# EAGLE design BeagleQ-v03.1 (EAGLE 6.6.0)
BOARD_NUMBER: 1.0
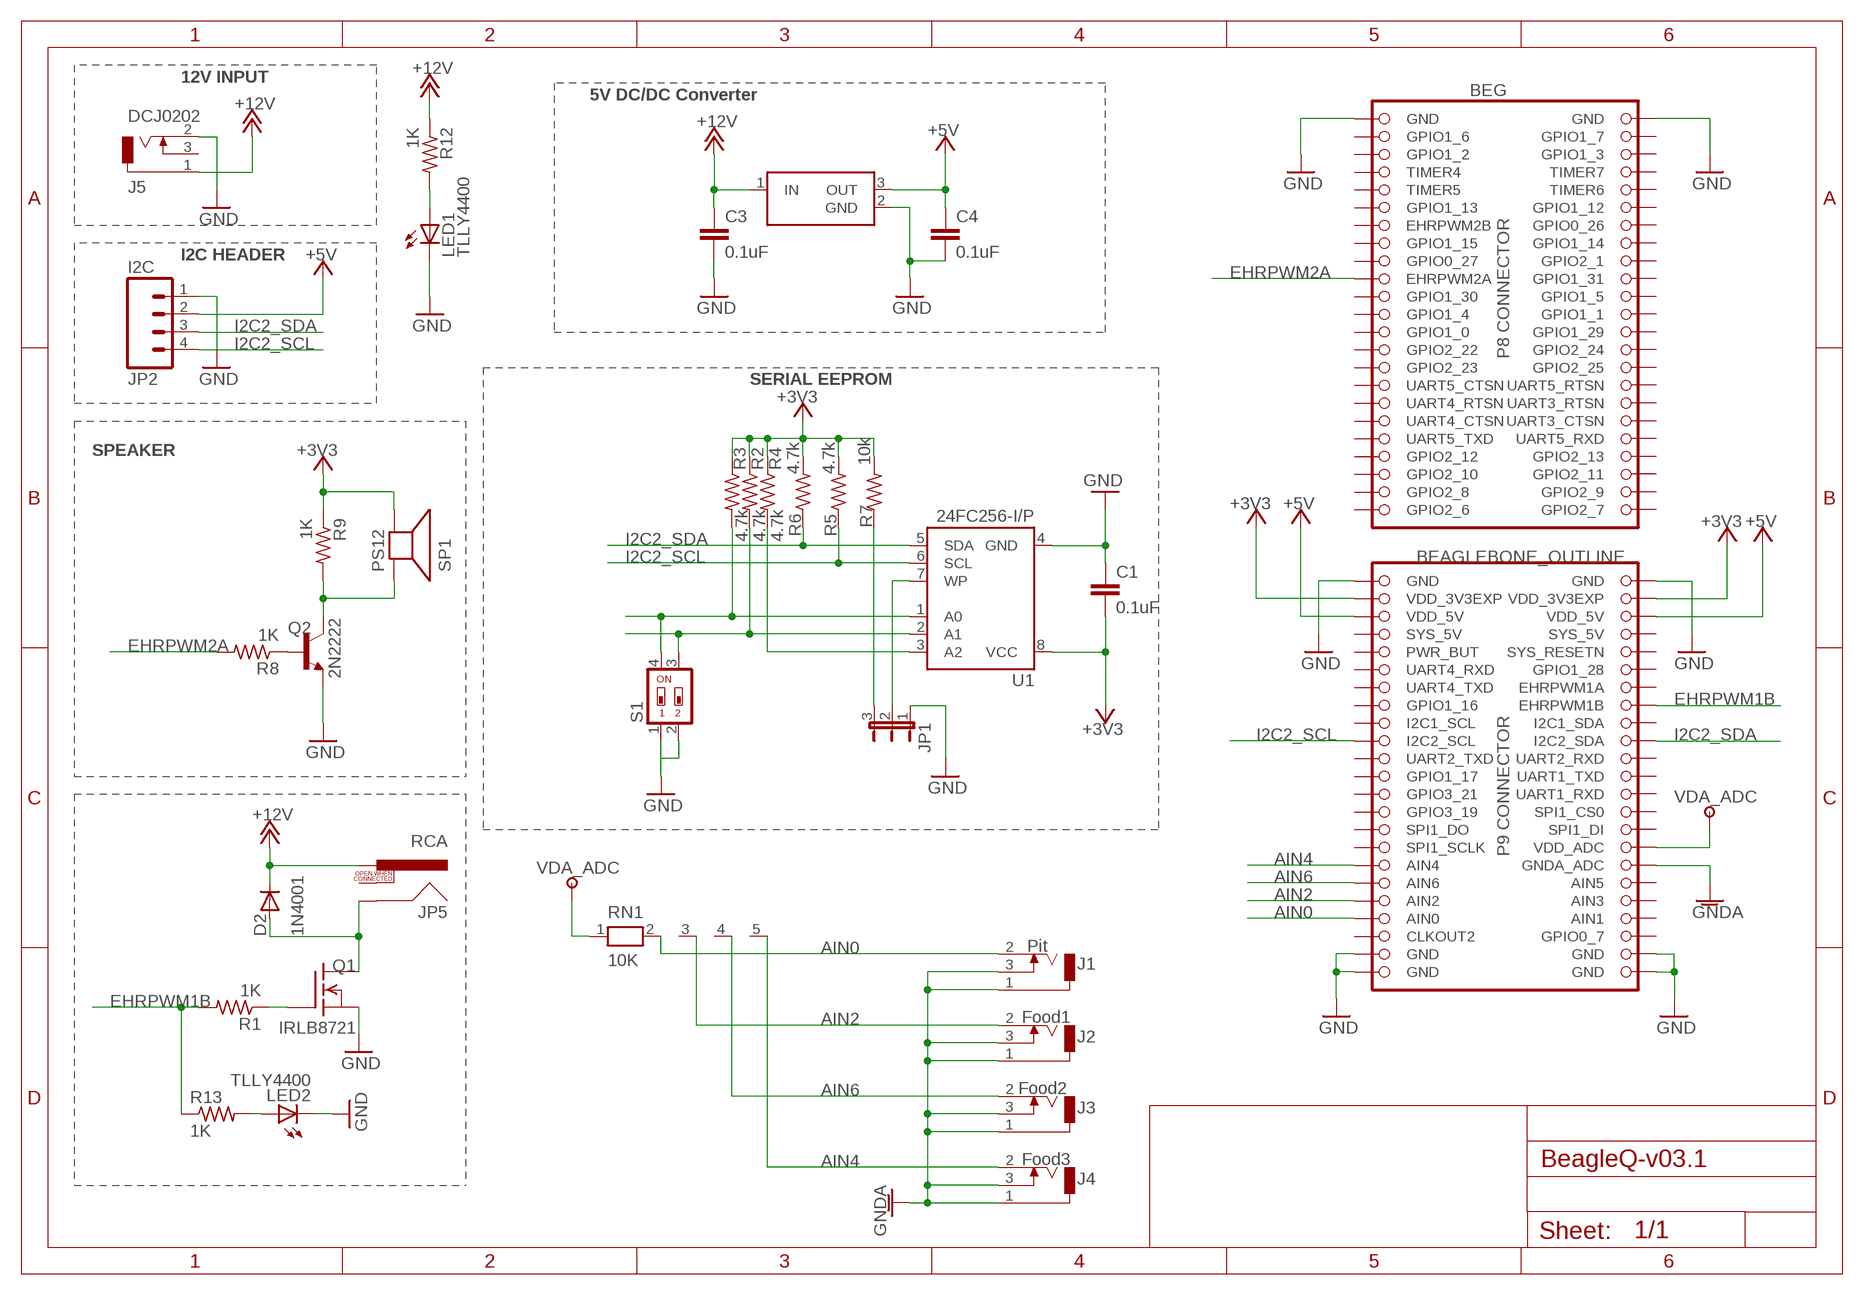
[diagram p0: schematic, sheet 1]

## Parts
BEG  BEAGLEBONE_OUTLINE  [BEAGLEBONE_SHIELD]
C1  0.1uF  C2.5/2  [C2.5-2]
C3  0.1uF  C2.5/2  [C2.5-2]
C4  0.1uF  C2.5/2  [C2.5-2]
D2  1N4001  1N4004  [DO41-10]
J1  Pit  MJ-2508N  [MJ-2508N]
J2  Food1  MJ-2508N  [MJ-2508N]
J3  Food2  MJ-2508N  [MJ-2508N]
J4  Food3  MJ-2508N  [MJ-2508N]
J5  DCJ0202  [DCJ0202]
JP1  WP  JP2E  [JP2]
JP2  I2C  M04PTH  [1X04]
JP5  RCA  [RCA]
LED1  TLLY4400  [LED3MM]
LED2  TLLY4400  [LED3MM]
Q1  IRLB8721  BUZ10  [TO220]
Q2  2N2222  [TO18]
R1  1K  R-US_0207/10  [0207/10]
R2  4.7k  R-US_0207/10  [0207/10]
R3  4.7k  R-US_0207/10  [0207/10]
R4  4.7k  R-US_0207/10  [0207/10]
R5  4.7k  R-US_0207/10  [0207/10]
R6  4.7k  R-US_0207/10  [0207/10]
R7  10k  R-US_0207/10  [0207/10]
R8  1K  R-US_0207/10  [0207/10]
R9  1K  R-US_0207/10  [0207/10]
R12  1K  R-US_0207/10  [0207/10]
R13  1K  R-US_0207/10  [0207/10]
RN1  10K  RN04  [RN-5]
S1  SWS002  [SMS-002]
SP1  PS12  SPEAKER/PS12  [PS12]
U1  24FC256-I/P  AT24CP  [DIL08]
U2  OKI-78SR  [OKI-78SR]

## Nets
+3V3: BEG.49(VDD_3V3EXP) BEG.50(VDD_3V3EXP) C1.2 R2.1 R3.1 R4.1 R5.2 R6.2 R7.2 R9.1 SP1.P$2(-) U1.8(VCC)
+5V [VDD]: BEG.51(VDD_5V) BEG.52(VDD_5V) C4.1 JP2.2 U2.3(OUT)
+12V: C3.1 D2.C J5.1 JP5.PIN R12.1 U2.1(IN)
AIN0: BEG.85(AIN0) J1.2 RN1.2
AIN2: BEG.83(AIN2) J2.2 RN1.3
AIN4: BEG.79(AIN4) J4.2 RN1.5
AIN6: BEG.81(AIN6) J3.2 RN1.4
BLOWER_L [VCC_12V]: D2.A JP5.SHELL Q1.2(D)
EHRPWM1B: BEG.62(EHRPWM1B) R1.2 R13.1
EHRPWM2A: BEG.19(EHRPWM2A) R8.2
GND [GND]: BEG.1(GND) BEG.2(GND) BEG.47(GND) BEG.48(GND) BEG.89(GND) BEG.90(GND) BEG.91(GND) BEG.92(GND) C1.1 C3.2 C4.2 J5.2 JP1.1 JP2.1 LED1.K(C) LED2.K(C) Q1.3(S) Q1.4(S) Q2.1(E) S1.1 S1.2 U1.4(GND) U2.2(GND)
GNDA: BEG.80(GNDA_ADC) J1.1 J1.3 J2.1 J2.3 J3.1 J3.3 J4.1 J4.3
I2C2_SCL: BEG.65(I2C2_SCL) JP2.4 R5.1 U1.6(SCL)
I2C2_SDA: BEG.66(I2C2_SDA) JP2.3 R6.1 U1.5(SDA)
N$1: R2.2 S1.3 U1.2(A1)
N$2: R3.2 S1.4 U1.1(A0)
N$3: JP1.2 U1.7(WP)
N$4: Q1.1(G) R1.1
N$5: JP1.3 R7.1
N$8: LED1.A R12.2
N$9: R4.2 U1.3(A2)
N$10: LED2.A R13.2
N$12: Q2.2(B) R8.1
N$13: Q2.3(C) R9.2 SP1.P$1(+)
VDA_ADC: BEG.78(VDD_ADC) RN1.1
Unconnected: BEG.3(GPIO1_6) BEG.4(GPIO1_7) BEG.5(GPIO1_2) BEG.6(GPIO1_3) BEG.7(TIMER4) BEG.8(TIMER7) BEG.9(TIMER5) BEG.10(TIMER6) BEG.11(GPIO1_13) BEG.12(GPIO1_12) BEG.13(EHRPWM2B) BEG.14(GPIO0_26) BEG.15(GPIO1_15) BEG.16(GPIO1_14) BEG.17(GPIO0_27) BEG.18(GPIO2_1) BEG.20(GPIO1_31) BEG.21(GPIO1_30) BEG.22(GPIO1_5) BEG.23(GPIO1_4) BEG.24(GPIO1_1) BEG.25(GPIO1_0) BEG.26(GPIO1_29) BEG.27(GPIO2_22) BEG.28(GPIO2_24) BEG.29(GPIO2_23) BEG.30(GPIO2_25) BEG.31(UART5_CTSN) BEG.32(UART5_RTSN) BEG.33(UART4_RTSN) BEG.34(UART3_RTSN) BEG.35(UART4_CTSN) BEG.36(UART3_CTSN) BEG.37(UART5_TXD) BEG.38(UART5_RXD) BEG.39(GPIO2_12) BEG.40(GPIO2_13) BEG.41(GPIO2_10) BEG.42(GPIO2_11) BEG.43(GPIO2_8) BEG.44(GPIO2_9) BEG.45(GPIO2_6) BEG.46(GPIO2_7) BEG.54(SYS_5V) BEG.55(PWR_BUT) BEG.56(SYS_RESETN) BEG.57(UART4_RXD) BEG.58(GPIO1_28) BEG.59(UART4_TXD) BEG.60(EHRPWM1A) BEG.61(GPIO1_16) BEG.63(I2C1_SCL) BEG.64(I2C1_SDA) BEG.67(UART2_TXD) BEG.68(UART2_RXD) BEG.69(GPIO1_17) BEG.70(UART1_TXD) BEG.71(GPIO3_21) BEG.72(UART1_RXD) BEG.73(GPIO3_19) BEG.74(SPI1_CS0) BEG.75(SPI1_DO) BEG.76(SPI1_DI) BEG.77(SPI1_SCLK) BEG.82(AIN5) BEG.84(AIN3) BEG.86(AIN1) BEG.87(CLKOUT2) BEG.88(GPIO0_7) J5.3 JP5.SWITCH

## Notes on the sheet
- 12V INPUT
- 5V DC/DC Converter
- I2C HEADER
- SERIAL EEPROM
- SPEAKER

## Power pins joined to a net without a drawn wire
SYS_5V: BEG.53(SYS_5V)

## Library data of the parts
BEG = BeagleQ-v03:BEAGLEBONE_OUTLINE: Should match A3 pinout - but not completely tested
C1 C3 C4 = capacitor-wima:C: CAPACITOR naming: grid - package width
D2 = BeagleQ-v03:1N4004: DIODE General purpose 1N400x type rectifier (With bigger pads) http://www.ladyada.net/library/pcb/eaglelibrary.html
J1-J4 = BeagleQ-v03:MJ-2508N
J5 = BeagleQ-v03:DCJ0202: DC POWER JACK Source: DCJ0202.pdf; OC_FARNELL: unknown; OC_NEWARK: unknown
JP1 = jumper:JP2E: JUMPER
JP2 = SparkFun-Connectors:M04: Header 4 Standard 4-pin 0.1" header. Use with straight break away headers (SKU : PRT-00116), right angle break away headers (PRT-00553), swiss pins (PRT-00743), machine pins (PRT-00117), and female headers (PRT-00115). Molex polarized connector foot print use with SKU : PRT-08231 with associated crimp pins and housings. 1MM SMD Version SKU: PRT-10208
JP5 = BeagleQ-v03:RCA
LED1 = led:TLLY4400: Low Current (2mA) LED 3 mm Tinted Diffused Package color YELLOW Source: Data sheet <http://www.farnell.com/datasheets/391098.pdf>; MF: VISHAY SEMICONDUCTOR; OC_FARNELL: 1612439
LED2 = BeagleQ-v03:TLLY4400: Low Current (2mA) LED 3 mm Tinted Diffused Package color YELLOW Source: Data sheet <http://www.farnell.com/datasheets/391098.pdf>; MF: VISHAY SEMICONDUCTOR; OC_FARNELL: 1612439
Q1 = BeagleQ-v03:BUZ10: N-Channel Enhancement MOSFET 50V; 20A; 0,080Ohm
Q2 = BeagleQ-v03:2N2222*: NPN Transistor
R1 R8 R9 = BeagleQ-v03:R-US_: RESISTOR, American symbol
R2-R7 R12 R13 = resistor:R-US_: RESISTOR, American symbol
RN1 = BeagleQ-v03:RN04: RESISTOR NETWORK; OC_FARNELL: unknown; OC_NEWARK: unknown
S1 = BeagleQ-v03:SWS002: SMD Dip Switch 2 pol.
SP1 = adafruit:SPEAKER: SPEAKER Source: Buerklin Added PS12 (for part # PS1240 piezo) http://www.ladyada.net/library/pcb/eaglelibrary.html
U1 = BeagleQ-v03:AT24C*: 2-wire serial EEPROM; MPN: AT24C1024BW-SH-B; OC_FARNELL: 1362646; OC_NEWARK: 03P2044
U2 = BeagleQ-v03:OKI-78SR

## Net classes
0 default: width 0.203 mm
1 VCC_12V: width 0.305 mm, drill 0.406 mm
2 VDD: width 0.305 mm, drill 0.406 mm
3 GND: width 0.254 mm, drill 0.406 mm

## Board
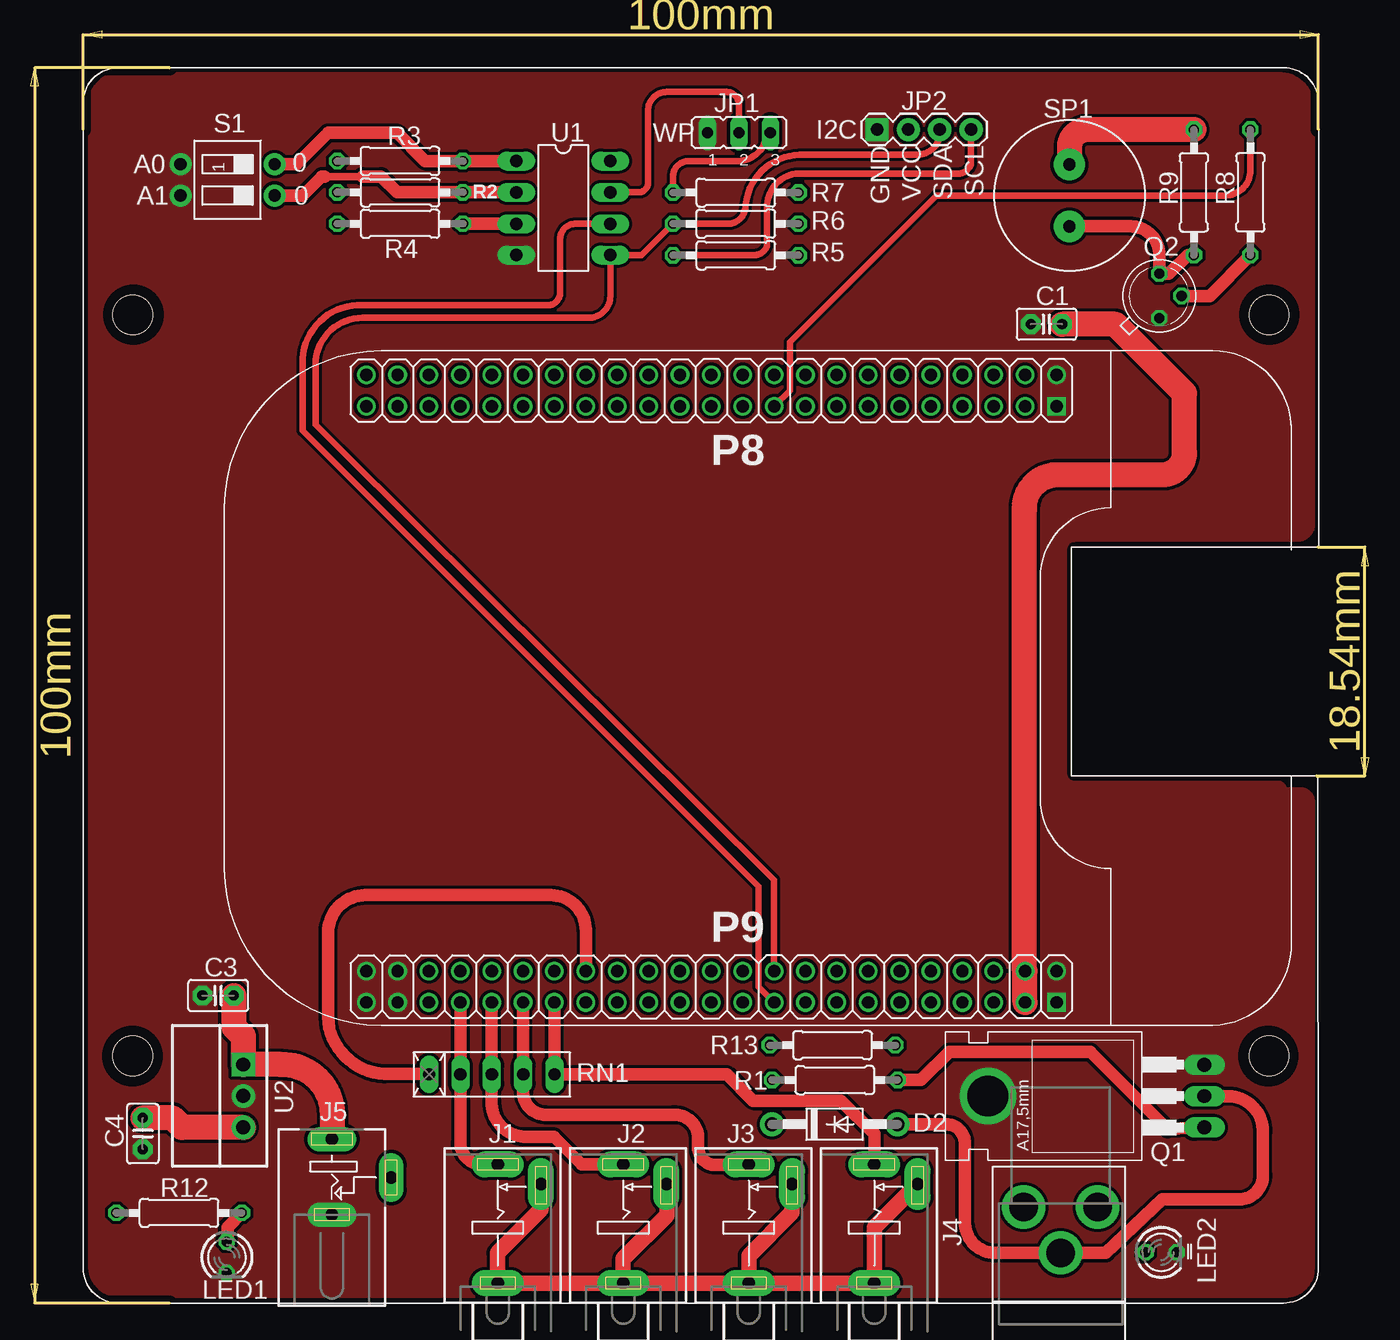
[diagram p1: board, top side]
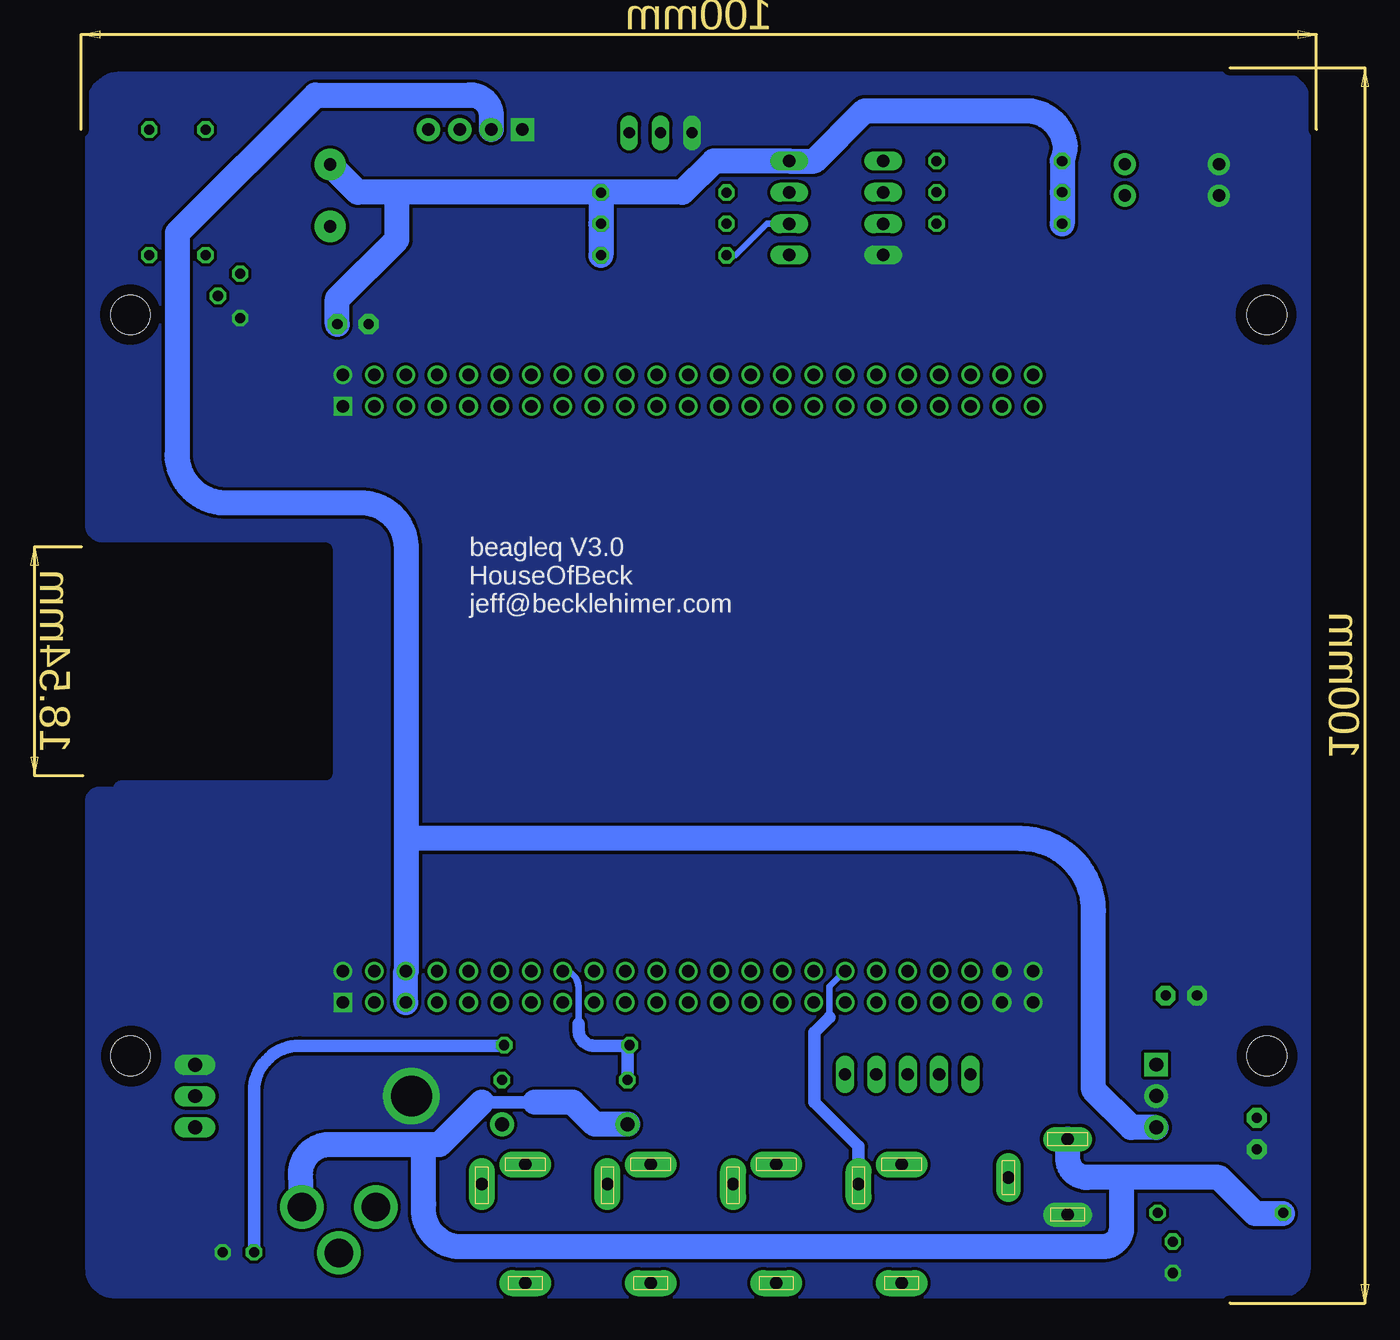
[diagram p2: board, bottom side, seen from below]

Size 108.3 x 102.99 mm. Coordinates in mm from the lower left corner, seen from the top.
Copper layers 1*16: Top 0.035mm / dielectric 1.5mm / Bottom 0.035mm
Design rules "dirt_cheap_dirty_boards.v1 *": minimum track width 5mil, minimum drill 12mil, track to track 10mil, track to pad 10mil, pad to pad 10mil, via to via 10mil, smd to smd 0mil, copper to edge 20mil, drill to drill 20mil, minimum pad ring 10mil, minimum via ring 6mil, stop-mask expansion 2mil, vias tented up to drill 25mil, thermal gap 10mil
tRestrict: area 98.1,77.8 to 102.4,82.2; area 6.1,77.8 to 10.5,82.2; area 6,17.8 to 10.4,22.2; area 98,17.8 to 102.4,22.2
bRestrict: area 98.1,77.8 to 102.4,82.2; area 6.1,77.8 to 10.5,82.2; area 6,17.8 to 10.4,22.2; area 98,17.8 to 102.4,22.2

### Footprints (pad centres in the part's own frame; a part is rotated, then mirrored left to right if it is on the bottom)
BEAGLEBONE_SHIELD = drill 1 square: 1 78.79,72.595; 47 78.79,24.335 | drill 1: 2 78.79,75.135; 3 76.25,72.595; 4 76.25,75.135; 5 73.71,72.595; 6 73.71,75.135; 7 71.17,72.595; 8 71.17,75.135; 9 68.63,72.595; 10 68.63,75.135; 11 66.09,72.595; 12 66.09,75.135; 13 63.55,72.595; 14 63.55,75.135; 15 61.01,72.595; 16 61.01,75.135; 17 58.47,72.595; 18 58.47,75.135; 19 55.93,72.595; 20 55.93,75.135; 21 53.39,72.595; 22 53.39,75.135; 23 50.85,72.595; 24 50.85,75.135; 25 48.31,72.595; 26 48.31,75.135; 27 45.77,72.595; 28 45.77,75.135; 29 43.23,72.595; 30 43.23,75.135; 31 40.69,72.595; 32 40.69,75.135; 33 38.15,72.595; 34 38.15,75.135; 35 35.61,72.595; 36 35.61,75.135; 37 33.07,72.595; 38 33.07,75.135; 39 30.53,72.595; 40 30.53,75.135; 41 27.99,72.595; 42 27.99,75.135; 43 25.45,72.595; 44 25.45,75.135; 45 22.91,72.595; 46 22.91,75.135; 48 78.79,26.875; 49 76.25,24.335; 50 76.25,26.875; 51 73.71,24.335; 52 73.71,26.875; 53 71.17,24.335; 54 71.17,26.875; 55 68.63,24.335; 56 68.63,26.875; 57 66.09,24.335; 58 66.09,26.875; 59 63.55,24.335; 60 63.55,26.875; 61 61.01,24.335; 62 61.01,26.875; 63 58.47,24.335; 64 58.47,26.875; 65 55.93,24.335; 66 55.93,26.875; 67 53.39,24.335; 68 53.39,26.875; 69 50.85,24.335; 70 50.85,26.875; 71 48.31,24.335; 72 48.31,26.875; 73 45.77,24.335; 74 45.77,26.875; 75 43.23,24.335; 76 43.23,26.875; 77 40.69,24.335; 78 40.69,26.875; 79 38.15,24.335; 80 38.15,26.875; 81 35.61,24.335; 82 35.61,26.875; 83 33.07,24.335; 84 33.07,26.875; 85 30.53,24.335; 86 30.53,26.875; 87 27.99,24.335; 88 27.99,26.875; 89 25.45,24.335; 90 25.45,26.875; 91 22.91,24.335; 92 22.91,26.875 | hole 3.2: 4,80; 96,80; 96,20; 4,20
C2.5-2 = drill 0.813 pad 1.6 octagon: 1 -1.27,0; 2 1.27,0
DO41-10 = drill 1.118 pad 1.93: A 5.08,0; C -5.08,0
MJ-2508N = drill 1 pad 2.1 long: 1 0,-6.52; 2 0,3.1; 3 3.5,1.5
DCJ0202 = drill 1 pad 2 long: 1 0,3.1; 2 0,-3; 3 4.8,0
JP2 = drill 0.914 long: 1 -2.54,0; 2 0,0; 3 2.54,0
1X04 = drill 1.016 pad 1.88 square: 1 0,0 | drill 1.016 pad 1.88: 2 2.54,0; 3 5.08,0; 4 7.62,0
RCA = drill 2.3 pad 3.5: PIN -3.7,3; SHELL 0,0; SWITCH -3.7,-3
LED3MM = drill 0.813 octagon: A -1.27,0; K 1.27,0
TO220 = drill 1.118 long: 1 -2.54,-6.35; 2 0,-6.35; 3 2.54,-6.35 | drill 3.302 pad 4.572: 4 0,11.176
TO18 = drill 0.813 octagon: 1 -1.27,-1.27; 2 1.27,-1.27; 3 1.27,1.27
0207/10 = drill 0.813 octagon: 1 -5.08,0; 2 5.08,0
RN-5 = drill 1 long: 1 -5.08,0; 2 -2.54,0; 3 0,0; 4 2.54,0; 5 5.08,0
SMS-002 = drill 1 pad 1.778: 1 -1.27,-3.81; 2 1.27,-3.81; 3 1.27,3.81; 4 -1.27,3.81
PS12 = drill 1 pad 2.54: P$1 -2.5,0; P$2 2.5,0
DIL08 = drill 1.016 long: 1 -3.81,-3.81; 2 -1.27,-3.81; 3 1.27,-3.81; 4 3.81,-3.81; 5 3.81,3.81; 6 1.27,3.81; 7 -1.27,3.81; 8 -3.81,3.81
OKI-78SR = drill 1.118 pad 1.905 square: 1 -2.54,0 | drill 1.118 pad 1.905: 2 0,0; 3 2.54,0

### Placement (x,y rotation side)
BEG  4.24,0 0 top
C1  82.21,79.25 0 top
C3  15.16,24.89 180 top
C4  9.06,13.72 270 top
D2  65.07,14.47 0 top
J1  37.8,8.13 0 top
J2  47.96,8.13 0 top
J3  58.12,8.13 0 top
J4  68.28,8.13 0 top
J5  24.37,10.16 0 top
JP1  57.32,94.74 0 top
JP2  68.5,95 0 top
JP5  83.36,4.06 270 top
LED1  15.86,3.7 270 top
LED2  91.5,4.11 0 top
Q1  88.65,16.75 90 top
Q2  91.36,81.53 45 top
R1  65.08,18.05 180 top
R2  29.89,89.92 0 top
R3  29.89,92.46 0 top
R4  29.89,87.38 0 top
R5  57.07,84.82 0 top
R6  57.07,87.38 0 top
R7  57.07,89.9 0 top
R8  98.72,89.92 90 top
R9  94.15,89.92 270 top
R12  12,7.3 0 top
R13  64.9,20.88 0 top
RN1  37.31,18.51 0 top
S1  15.92,90.93 270 top
SP1  84.07,89.66 90 top
U1  43.1,88.65 270 top
U2  17.19,16.76 270 top

### Tracks (layer width: path | path; a pad name or v marks a point on that pad's centre or on a via)
+3V3
  Top 2.032: BEG.49 BEG.50 arc-90 80.44,26.93 80.44,64.26 arc-90 82.98,67.06 91.61,67.06 arc90 93.39,68.83 93.39,73.66 87.8,79.25 C1.2 | R9.1 85.52,95 arc90 84.07,93.55 SP1.P$2
  Bottom 2.032: R5.2 R6.2 R7.2 | R7.2 62.13,89.92 55.55,89.92 53.01,92.46 U1.8 44.88,92.46 40.81,96.52 27.86,96.52 arc90 24.56,93.47 R3.1 R2.1 R4.1 | R7.2 arc-90 62.16,89.92 78.66,89.92 | 78.66,89.92 81.83,89.92 SP1.P$2 | C1.2 83.48,81.28 78.66,86.11 78.66,89.92
+5V
  Top 2.032: U2.3 12.24,14.22 11.48,14.99 C4.1
  Bottom 2.032: U2.3 19.22,14.22 22.27,17.27 22.27,31.75 arc-90 28.11,37.59 77.9,37.59 | BEG.51 BEG.52 arc-90 77.9,26.93 77.9,37.59 | 77.9,37.59 77.9,61.21 arc-90 81.71,64.77 92.63,64.77 arc90 96.44,68.83 96.44,86.61 85.26,97.79 72.82,97.79 arc90 71.04,96.27 JP2.2
+12V
  Top 1.016: J5.1 arc90 24.43,13.32
  Top 2.032: 24.43,13.32 24.43,15.37 arc90 20.24,19.3 U2.1 17.19,21.59 16.43,22.35 C3.1
  Bottom 1.016: R12.1 arc90 6.98,7.24 | 67.48,16.26 71.8,16.26
  Bottom 2.032: 6.98,7.24 9.19,7.24 12.11,10.16 19.98,10.16 | 76.5,12.83 75.23,12.83 71.8,16.26 | 76.5,12.83 84.12,12.83 arc-90 86.48,10.46 JP5.PIN | D2.C 62.65,14.47 64.44,16.26 67.48,16.26 | 76.5,12.83 76.5,8 arc-90 73.83,4.57 21.51,4.57 arc-90 19.98,6.1 19.98,10.16 | 19.98,10.16 22.78,10.16 arc90 24.37,11.75 J5.1
AIN0
  Top 0.508: BEG.85
  Top 1.016: BEG.85 RN1.2 34.77,12.98 arc90 36.53,11.23 J1.2
AIN2
  Top 0.508: BEG.83
  Top 1.016: BEG.83 RN1.3 37.31,16.33 arc90 39.92,13.46 42.34,13.46 44.57,11.23 J2.2
AIN4
  Top 0.508: BEG.79
  Top 1.016: BEG.79 RN1.5 56.34,18.51 58.47,16.38 65.58,16.38 68.28,13.68 J4.2
AIN6
  Top 0.508: BEG.81
  Top 1.016: BEG.81 RN1.4 39.85,17.09 arc90 41.7,15.24 51.99,15.24 arc-90 54.02,13.46 54.02,12.45 arc90 55.55,11.18 58.07,11.18 arc90 J3.2
BLOWER_L
  Top 1.016: Q1.2 96.96,16.75 arc-90 99.74,13.84 99.74,10.41 arc-90 97.84,8.38 91.61,8.38 87.04,4.06 JP5.SHELL 78.28,4.06 arc-90 75.61,6.35 75.61,12.95 arc90 74.09,14.47 D2.A
EHRPWM1B
  Bottom 0.508: 63.98,22.61 63.98,25.63 arc-90 BEG.62
  Bottom 1.016: R1.2 60.01,20.69 R13.1 arc90 59.87,20.83 62.68,20.83 arc90 63.95,22.1 63.98,22.61
EHRPWM2A
  Top 0.508: R8.2 98.72,91.69 arc-90 96.69,89.66 73.32,89.66 61.44,77.78 61.44,73.87 BEG.19
GND
  pour Top (no thermals): 7.29,99.57 100.76,99.57 101.01,99.57 arc-90 103.8,96.77 103.8,62.99 arc-90 102.53,61.72 84.5,61.72 arc90 83.74,60.96 83.74,42.93 arc90 84.5,42.16 101.01,42.16 arc-90 101.52,41.66 102.79,41.66 arc-90 103.8,40.64 103.8,2.79 arc-90 101.52,0.51 7.29,0.51 arc-90 4.75,3.05 4.75,97.03 arc-90
  pour Bottom (no thermals): 7.29,99.57 101.01,99.57 arc-90 103.8,96.77 103.8,62.99 arc-90 102.53,61.72 84.5,61.72 arc90 83.74,60.96 83.74,42.93 arc90 84.5,42.16 101.01,42.16 arc-90 101.52,41.66 102.79,41.66 arc-90 103.8,40.64 103.8,2.79 arc-90 101.52,0.51 7.29,0.51 arc-90 4.75,3.05 4.75,97.03 arc-90
GNDA
  Top 1.27: J2.1 J1.1 37.77,1.64 37.77,4.06 41.3,7.6 J1.3 | J2.1 J3.1 | J3.1 J4.1 68.28,6.13 J4.3 | J2.1 47.96,3.59 51.48,7.11 51.48,9.6 J2.3 | J3.1 58.12,3.84 61.62,7.34 J3.3
  Bottom 0.508: 43.66,23.11 43.66,25.66 BEG.80
  Bottom 1.016: 37.77,1.64 J1.1 | J1.3 41.3,12.68 44.88,16.26 44.88,21.89 43.66,23.11
I2C2_SCL
  Top 0.508: BEG.65 58.9,25.6 58.9,33.73 22.02,70.61 22.02,76.45 arc-90 26.84,80.77 41.83,80.77 arc90 42.84,81.79 42.84,86.11 arc-90 44.12,87.38 U1.6 | R5.1 arc-90 52.01,84.84 58.59,84.84 arc90 59.61,85.85 59.61,88.9 arc-90 62.4,91.44 75.1,91.44 arc90 76.12,92.46 JP2.4
  Bottom 0.508: R5.1 51.24,84.82 48.69,87.38 U1.6
I2C2_SDA
  Top 0.508: BEG.66 60.17,34.24 25.06,69.09 23.03,71.12 23.03,75.95 arc-90 26.84,79.76 45.13,79.76 arc90 46.91,81.53 U1.5 49.45,84.84 R6.1 56.56,87.38 arc90 57.83,88.9 57.83,88.65 arc-90 62.66,92.96 71.8,92.96 arc90 73.58,94.74 JP2.3
N$1
  Top 0.61: 23.8,91.19 26.84,91.19
  Top 1.016: U1.2 R2.2 29.64,89.92 28.37,91.19 26.84,91.19 | S1.3 22.02,89.66 23.54,91.19 23.8,91.19
N$2
  Top 1.016: S1.4 21.51,92.2 24.05,94.74 29.64,94.74 31.92,92.46 R3.2 U1.1
N$3
  Top 0.508: U1.7 49.2,89.92 arc90 49.96,90.68 49.96,96.52 arc-90 51.48,98.04 56.31,98.04 arc-90 57.32,97.03 JP1.2
N$4
  Top 1.016: R1.1 72.07,18.05 74.34,20.32 85.77,20.32 92,14.09 Q1.1
N$5
  Top 0.508: R7.1 51.99,91.19 arc-90 53.26,92.46 57.07,92.46 arc90 59.61,94.74 JP1.3
N$8
  Top 1.016: LED1.A arc90 15.92,5.03 15.92,6.14 R12.2
N$9
  Top 1.016: U1.3 R4.2
N$10
  Bottom 1.016: LED2.A 90.23,17.13 arc90 86.53,20.83 70.03,20.83 R13.2
N$12
  Top 1.016: Q2.2 95.42,81.53 R8.1
N$13
  Top 1.016: R9.2 93.64,84.84 92.14,83.33 Q2.3 91.36,84.84 arc90 89.03,87.16 SP1.P$1
VDA_ADC
  Top 1.016: RN1.1 arc90 32.2,18.54 28.62,18.54 arc-90 24.05,23.62 24.05,29.97 arc-90 27.1,33.02 42.08,33.02 arc-90 44.93,30.18 BEG.78

### Text on the board
tPlace: WP | I2C | GND | VCC | SDA | SCL | 0 | A0 | A1 | 0
bPlace: beagleq V3.0 / HouseOfBeck / jeff@becklehimer.com
tOrigins: 1 | 1 | 1